# EAGLE design sls_v1.0 (EAGLE 9.6.2)
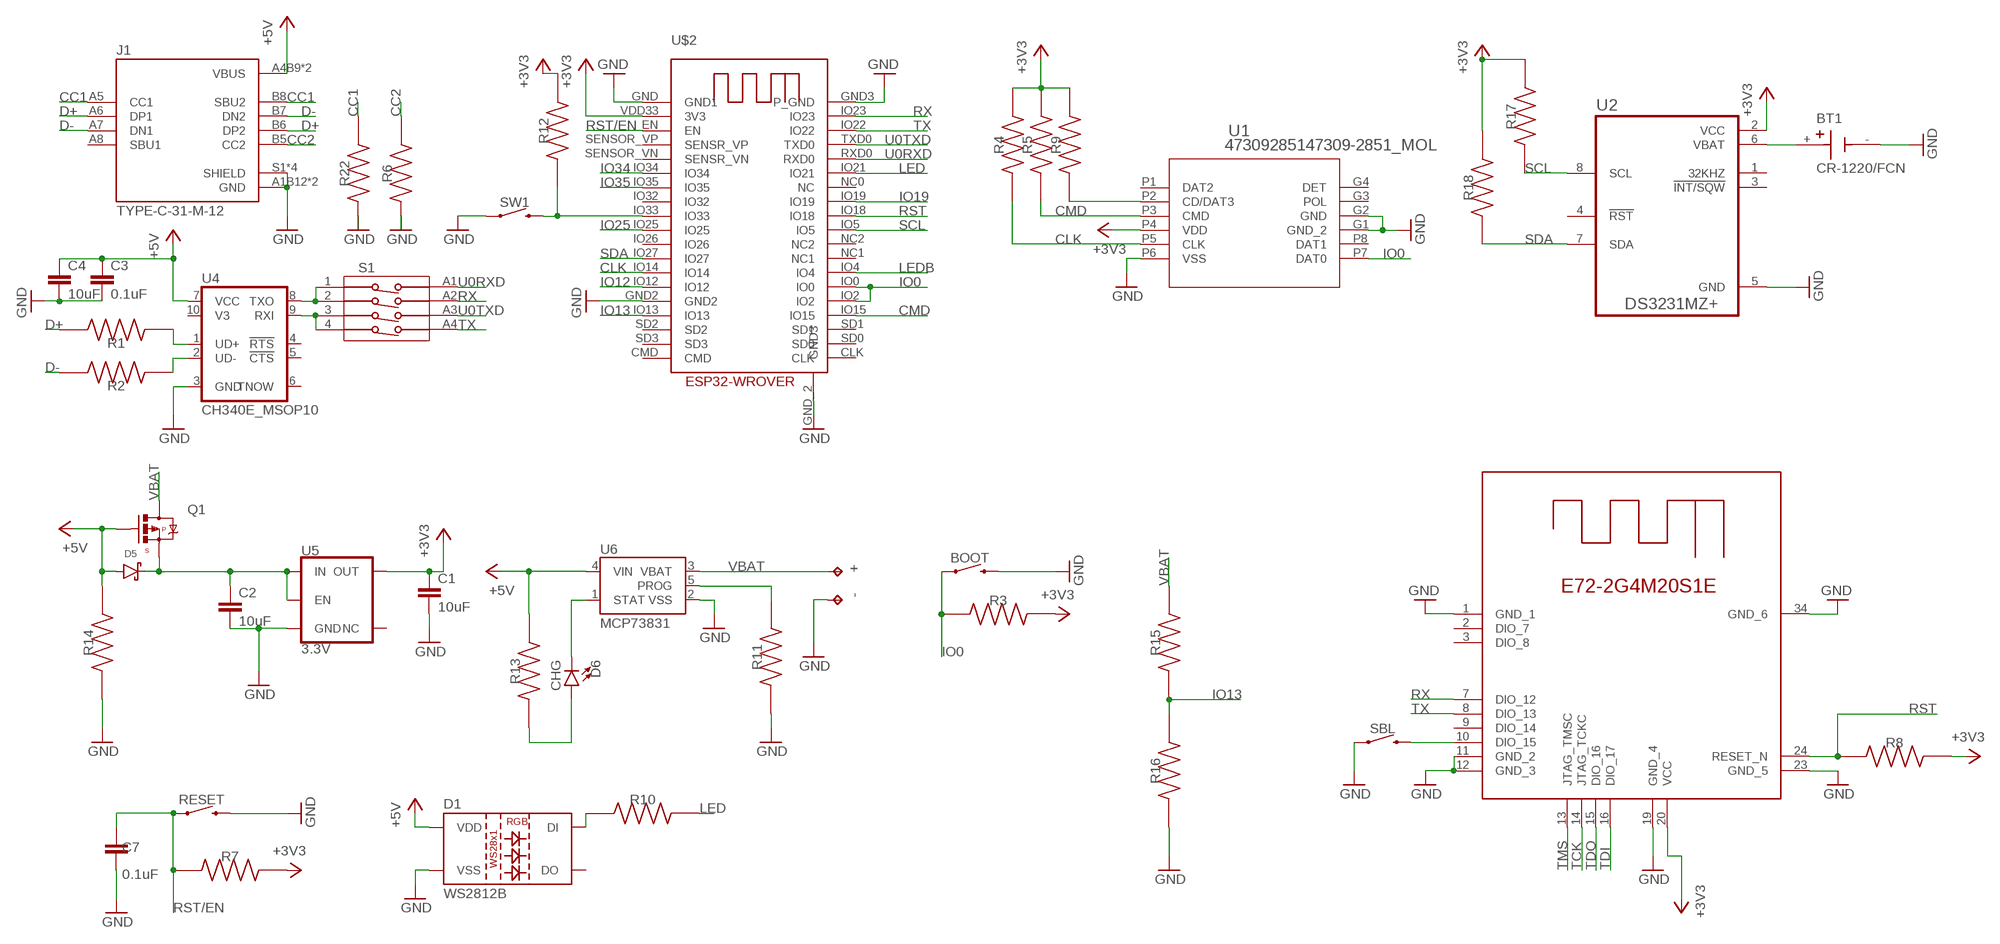
[diagram p0: schematic, sheet 1]

## Parts
+  TPTP14R  [TP14R]
-  TPTP14R  [TP14R]
BOOT  MOMENTARY-SWITCH-SPST-SMD-4.6X2.8MM  [TACTILE_SWITCH_SMD_4.6X2.8MM]
BT1  CR-1220/FCN  [BAT_CR-1220/FCN]
C1  10uF  10UF-0805-10V-10%  [0805]
C2  10uF  10UF-0805-10V-10%  [0805]
C3  0.1uF  0.1UF-0603-25V-(+80/-20%)  [0603]
C4  10uF  10UF-0603-6.3V-20%  [0603]
C7  0.1uF  0.1UF-0603-25V-5%  [0603]
D1  WS2812B  [WS2812B]
D5  DIODE-SCHOTTKY  [SOD-323]
D6  CHG  LED-BLUE0603  [LED-0603]
J1  TYPE-C-31-M-12  [HRO_TYPE-C-31-M-12]
Q1  MOSFET-PCHANNEL  [SOT23]
R1  RC0402FR-073M6L  [RESC1005X40N]
R2  RC0402FR-073M6L  [RESC1005X40N]
R3  RC0402FR-073M6L  [RESC1005X40N]
R4  RC0402FR-073M6L  [RESC1005X40N]
R5  RC0402FR-073M6L  [RESC1005X40N]
R6  5.1k  RC0402FR-073M6L  [RESC1005X40N]
R7  RC0402FR-073M6L  [RESC1005X40N]
R8  100k  RC0402FR-073M6L  [RESC1005X40N]
R9  RC0402FR-073M6L  [RESC1005X40N]
R10  RC0402FR-073M6L  [RESC1005X40N]
R11  2.7k  RC0402FR-073M6L  [RESC1005X40N]
R12  RC0402FR-073M6L  [RESC1005X40N]
R13  RC0402FR-073M6L  [RESC1005X40N]
R14  RC0402FR-073M6L  [RESC1005X40N]
R15  RC0402FR-073M6L  [RESC1005X40N]
R16  RC0402FR-073M6L  [RESC1005X40N]
R17  RC0402FR-073M6L  [RESC1005X40N]
R18  RC0402FR-073M6L  [RESC1005X40N]
R22  5.1k  RC0402FR-073M6L  [RESC1005X40N]
RESET  MOMENTARY-SWITCH-SPST-SMD-4.6X2.8MM  [TACTILE_SWITCH_SMD_4.6X2.8MM]
S1  416131160804  [416131160804]
SBL  MOMENTARY-SWITCH-SPST-SMD-4.6X2.8MM  [TACTILE_SWITCH_SMD_4.6X2.8MM]
SW1  MOMENTARY-SWITCH-SPST-SMD-4.6X2.8MM  [TACTILE_SWITCH_SMD_4.6X2.8MM]
U1  47309285147309-2851_MOL  [47309-2851_MOL]
U2  DS3231MZ+  [SOIC127P600X175-8N]
U4  CH340E_MSOP10  [MSOP10]
U5  3.3V  V_REG_AP2112K-3.3V  [SOT23-5]
U6  MCP73831  [SOT23-5]
U$1  E72-2G4M20S1E  [E72-2G4M20S1E]
U$2  ESP32-WROVER  [ESP32-WROVER]

## Nets
+3V3: C1.1 R3.2 R4.2 R5.2 R7.2 R8.2 R9.2 R12.2 R17.2 R18.2 U1.P4(VDD) U2.2(VCC) U5.5(OUT) U$1.20(VCC) U$2.VDD33(3V3)
+5V: C3.1 C4.1 D1.1(VDD) D5.A J1.A4B9(VBUS) J1.B4A9(VBUS) Q1.1(G) R13.2 R14.2 U4.7(VCC) U6.4(VIN)
CC1: J1.A5(CC1) J1.B8(SBU2) R22.2
CC2: J1.B5(CC2) R6.2
CLK: R4.1 U1.P5(CLK) U$2.IO14
CMD: R5.1 U1.P3(CMD) U$2.IO15
D+: J1.A6(DP1) J1.B6(DP2) R1.2
D-: J1.A7(DN1) J1.B7(DN2) R2.2
GND: -.TP BOOT.3 BOOT.4 BT1.- C1.2 C2.2 C3.2 C4.2 C7.2 D1.3(VSS) J1.A1B12(GND) J1.B1A12(GND) J1.S1(SHIELD) J1.S2(SHIELD) J1.S3(SHIELD) J1.S4(SHIELD) R6.1 R11.1 R14.1 R16.1 R22.1 RESET.3 RESET.4 SBL.1 SBL.2 SW1.1 SW1.2 U1.G1(GND_2) U1.G2(GND) U1.P6(VSS) U2.5(GND) U4.3(GND) U5.2(GND) U6.2(VSS) U$1.1(GND_1) U$1.11(GND_2) U$1.12(GND_3) U$1.19(GND_4) U$1.23(GND_5) U$1.34(GND_6) U$2.GND2 U$2.GND3(P_GND) U$2.GND(GND1) U$2.GND_2(GND3)
IO0: BOOT.1 BOOT.2 R3.1 U1.P7(DAT0) U$2.IO0 U$2.IO2
IO12: U$2.IO12
IO13: R15.1 R16.2 U$2.IO13
IO19: U$2.IO19
IO25: U$2.IO25
IO34: U$2.IO34
IO35: U$2.IO35
LED: R10.2 U$2.IO21
LEDB: U$2.IO4
N$1: BT1.+ U2.6(VBAT)
N$2: R1.1 U4.1(UD+)
N$3: S1.1 S1.2 U4.8(TXO)
N$4: S1.3 S1.4 U4.9(RXI)
N$5: C2.1 D5.C Q1.2(S) U5.1(IN) U5.3(EN)
N$6: R12.1 SW1.3 SW1.4 U$2.IO33
N$7: R2.1 U4.2(UD-)
N$8: SBL.3 SBL.4 U$1.10(DIO_15)
N$9: R9.1 U1.P2(CD/DAT3)
N$10: R11.2 U6.5(PROG)
N$11: D6.A R13.1
N$12: D1.4(DI) R10.1
N$13: D6.C U6.1(STAT)
RST: R8.1 U$1.24(RESET_N) U$2.IO18
RST/EN: C7.1 R7.1 RESET.1 RESET.2 U$2.EN
RX: S1.A2 U$1.7(DIO_12) U$2.IO23
SCL: R17.1 U2.8(SCL) U$2.IO5
SDA: R18.1 U2.7(SDA) U$2.IO27
TCK: U$1.14(JTAG_TCKC)
TDI: U$1.16(DIO_17)
TDO: U$1.15(DIO_16)
TMS: U$1.13(JTAG_TMSC)
TX: S1.A4 U$1.8(DIO_13) U$2.IO22
U0RXD: S1.A1 U$2.RXD0
U0TXD: S1.A3 U$2.TXD0
VBAT: +.TP Q1.3(D) R15.2 U6.3(VBAT)
Unconnected: D1.2(DO) J1.A8(SBU1) U1.G3(POL) U1.G4(DET) U1.P1(DAT2) U1.P8(DAT1) U2.1(32KHZ) U2.3(!INT/SQW) U2.4(!RST) U4.4(!RTS) U4.5(!CTS) U4.6(TNOW) U4.10(V3) U5.4(NC) U$1.2(DIO_7) U$1.3(DIO_8) U$1.9(DIO_14) U$2.CLK U$2.CMD U$2.IO26 U$2.IO32 U$2.NC0(NC) U$2.NC1 U$2.NC2 U$2.SD0 U$2.SD1 U$2.SD2 U$2.SD3 U$2.SENSOR_VN(SENSR_VN) U$2.SENSOR_VP(SENSR_VP)

## Library data of the parts
+ - = testpad:TP: Test pad
BOOT RESET SBL SW1 = SparkFun-Switches:MOMENTARY-SWITCH-SPST: Momentary Switch (Pushbutton) - SPST Normally-open (NO) SPST momentary switches (buttons, pushbuttons). Variants PTH-12MM - 12mm square, through-hole Momentary Pushbutton Switch - 12mm Square <https://www.sparkfun.com/products/9190> (COM-09190) PTH-6.0MM, PTH-6.0MM-KIT - 6.0mm square, through-hole Mini Pushbutton Switch <https://www.sparkfun.com/products/97> (COM-00097) KIT package intended for soldering kit's - only one side of pads' copper is exposed. PTH-RIGHT-ANGLE-KIT - Right-angle, through-hole Right Angle Tactile Button <https://www.sparkfun.com/products/10791> - Used on SparkFun BigTime Watch Kit <https://www.sparkfun.com/products/11734> SMD-12MM - 12mm square, surface-mount Tactile Button - SMD (12mm) <https://www.sparkfun.com/products/12993> (COM-12993) Used on SparkFun PicoBoard <https://www.sparkfun.com/products/11888> SMD-4.5MM - 4.5mm Square Trackball Switch Used on SparkFun Blackberry Trackballer Breakout <https://www.sparkfun.com/products/13169> SMD-4.6MMX2.8MM - 4.60mm x 2.80mm, surface mount Used on SparkFun SAMD21 Mini Breakout <https://www.sparkfun.com/products/13664> SMD-5.2MM, SMD-5.2-REDUNDANT - 5.2mm square, surface-mount Mini Pushbutton Switch - SMD <https://www.sparkfun.com/products/8720> (COM-08720) Used on Arduino Pro Mini <https://www.sparkfun.com/products/11114> REDUNDANT package connects both switch circuits together SMD-6.0X3.5MM - 6.0 x 3.5mm, surface mount Momentary Reset Switch SMD <https://www.sparkfun.com/products/8229> (COM-08229) SMD-6.2MM-TALL - 6.2mm square, surface mount Tactile Button - SMD (6mm) <https://www.sparkfun.com/products/12992> Used on SparkFun Digital Sandbox <https://www.sparkfun.com/products/12651> SMD-RIGHT-ANGLE - Right-angle, surface mount Used on SparkFun Block for Intel® Edison - Arduino <https://www.sparkfun.com/products/13036>; PROD_ID: SWCH-13065
BT1 = CR-1220_FCN:CR-1220/FCN: Coin, 12.5mm Lithium Manganese Dioxide 3V Battery Non-Rechargeable (Primary) Check prices <https://pricing.snapeda.com/parts/CR-1220/FCN/Panasonic%20-/view-part?ref=eda>; AVAILABILITY: In Stock; DESCRIPTION: Coin, 12.5mm Lithium Manganese Dioxide 3V Battery Non-Rechargeable (Primary); MF: Panasonic -; MP: CR-1220/FCN; PACKAGE: Panasonic -; PRICE: None; PURCHASE-URL: https://pricing.snapeda.com/search/part/CR-1220/FCN/?ref=eda
C1 C2 = SparkFun-Capacitors:10UF: 10.0µF ceramic capacitors A capacitor is a passive two-terminal electrical component used to store electrical energy temporarily in an electric field.; PROD_ID: CAP-11330
C3 = SparkFun-Capacitors:0.1UF: 0.1µF ceramic capacitors A capacitor is a passive two-terminal electrical component used to store electrical energy temporarily in an electric field.; PROD_ID: CAP-00810
C4 = SparkFun-Capacitors:10UF: 10.0µF ceramic capacitors A capacitor is a passive two-terminal electrical component used to store electrical energy temporarily in an electric field.; PROD_ID: CAP-11015
C7 = SparkFun-Capacitors:0.1UF: 0.1µF ceramic capacitors A capacitor is a passive two-terminal electrical component used to store electrical energy temporarily in an electric field.; PROD_ID: CAP-08604
D1 = SparkFun-LED:WS2812B: WS2812B SMD addressable RGB LED 5x5mm SMD LED with built-in controller IC. Color: Red/Green/Blue mC Rating: RGB: 390, 660, 180 mcd Forward Voltage: RGB: 2.0, 3.0, 3.0 V Packages:WS2812B SparkFun Products: Blynk Board - ESP8266 <https://www.sparkfun.com/products/13794>; PROD_ID: DIO-12503
D5 = pimoroni-passives:DIODE-SCHOTTKY
D6 = SparkFun-LED:LED-BLUE: Blue SMD LED Used in manufacturing of various products at SparkFun Packages: 0603 - SMD 0603 package [Product Link] <http://www.digikey.com/product-detail/en/SMLE12BC7TT86/511-1589-2-ND/1641808> 1206 - SMD1206 package [Product Link] <http://www.digikey.com/product-detail/en/lite-on-inc/LTST-C150TBKT/160-1643-1-ND/573584> SparkFun Products: ESP8266 Thing-Dev Board <https://www.sparkfun.com/products/13711> RedBoard <https://www.sparkfun.com/products/12757>; PROD_ID: DIO-08575; VALUE: BLUE
J1 = TYPE-C-31-M-12:TYPE-C-31-M-12: USB Connectors 24 Receptacle 1 8.94*7.3mm RoHS; AVAILABILITY: Unavailable; DESCRIPTION: USB Connectors 24 Receptacle 1 8.94*7.3mm RoHS; MF: HRO Electronics Co., Ltd.; MP: TYPE-C-31-M-12; PACKAGE: Package; PRICE: None
Q1 = pimoroni-passives:MOSFET-PCHANNEL: Generic PMOSFET
R1-R18 R22 = RC0402FR-073M6L:RC0402FR-073M6L: RESISTOR, 0402 0.063W 1% 3M6; Resistance:3.6Mohm; Resistance Tolerance:± 1%; Power Rating:0.063W; Voltage Rating:50V; Series:RC32H; Temperature Coefficient:± 100ppm/°C; Resistor Element Type:Thick Film; Resistor Case Style:0402; No. of Pins:2; SVHC:No SVHC; Case Style:0402; External Length / Height:1mm; Temperature Coeff. +:100ppm/°C; Temperature Coeff. -:100ppm/°C; External Depth:0.35mm; External Width:0.5mm; Operating Temperature Range:-55°C to +155°C; Overload Voltage:100V Check prices <https://pricing.snapeda.com/parts/RC0402FR-073M6L/Yageo/view-part?ref=eda>; AVAILABILITY: Good; DESCRIPTION: RESISTOR, 0402 0.063W 1% 3M6; Resistance:3.6Mohm; Resistance Tolerance:± 1%; Power Rating:0.063W; Voltage Rating:50V; Series:RC32H; Temperature Coefficient:± 100ppm/°C; Resistor Element Type:Thick Film; Resistor Case Style:0402; No. of Pins:2; SVHC:No SVHC; Case Style:0402; External Length / Height:1mm; Temperature Coeff. +:100ppm/°C; Temperature Coeff. -:100ppm/°C; External Depth:0.35mm; External Width:0.5mm; Operating Temperature Range:-55°C to +155°C; Overload Voltage:100V; MF: Yageo; MP: RC0402FR-073M6L; PACKAGE: 1005 Panasonic Electronic Components; PRICE: None; PURCHASE-URL: https://pricing.snapeda.com/search/part/RC0402FR-073M6L/?ref=eda
S1 = Dip_Switch_SPST_4:416131160804: WS-DISV 1.27mm small compact SMD flat actuator with top tape Specification MATERIAL PROPERTIES: Cover Material PPA Cover Flammability Rating UL94 V-0 Cover Color Brown Base Material PPA Base Flammability Rating UL94 V-0 Base Color Brown Actuator Material PA46 Actuator Flammability Rating UL94 V-0 Actuator Color White Contact Plating Gold Terminal Plating Gold ELECTRICAL PROPERTIES: Rated Current Switching 25 mA Rated Current Non-Switching 100 mA Contact Resistance Initial 100 mΩ Contact Resistance After Life Test 200 mΩ Insulation Resistance 100 MΩ Withstanding Voltage 300 V (AC) MECHANICAL PROPERTIES: Operation Force 500 g Electrical Life 1000 Cycles Mechanical Life min. 2000 cycles Actuator Type Flat Type Switch Position Off <http://katalog.we-online.de/media/images/v2/Family_WS-DISV_SMD_FLAT_ACTUATOR_4161311608xx_4C.jpg> Details see: http://katalog.we-online.de/en/em/DISV_1_27_SMALL_COMPACT_SMD_FLAT_ACTUATOR/416131160804 2015 (C) Wurth Elektronik Check prices <https://pricing.snapeda.com/parts/416131160804/Wurth%20Elektronik/view-part?ref=eda>; AVAILABILITY: In Stock; DESCRIPTION: Dip Switch SPST 4 Position Surface Mount Slide (Standard) Actuator 25mA 24VDC; MF: Wurth Elektronik; MP: 416131160804; PACKAGE: None; PRICE: None; PURCHASE-URL: https://pricing.snapeda.com/search/part/416131160804/?ref=eda
U1 = microSD_smt:473092851; COPYRIGHT: Copyright (C) 2021 Ultra Librarian. All rights reserved.; MANUFACTURER_PART_NUMBER: 473092851; MFR_NAME: Molex Connector Corporation
U2 = DS3231MZ_:DS3231MZ+: Check prices <https://pricing.snapeda.com/parts/DS3231MZ%2B/Maxim%20Integrated/view-part?ref=eda>; AVAILABILITY: Warning; DESCRIPTION: Real Time Clock (RTC) IC Clock/Calendar I²C, 2-Wire Serial 8-SOIC (0.154, 3.90mm Width); MF: Maxim Integrated; MP: DS3231MZ+; PACKAGE: SOIC-8 Maxim; PRICE: None; PURCHASE-URL: https://pricing.snapeda.com/search/part/DS3231MZ+/?ref=eda
U4 = CH340E:CH340E: Check prices <https://pricing.snapeda.com/parts/CH340E/WCH/view-part?ref=eda>; AVAILABILITY: Not in stock; DESCRIPTION: USB to serial chip CH340; MF: WCH; MP: CH340E; PACKAGE: Package; PRICE: None
U5 = SparkFun-IC-Power:V_REG_AP2112: AP2112 - 600mA CMOS LDO Regulator w/ Enable The AP2112 is CMOS process low dropout linear regulator with enable function, the regulator delivers a guaranteed 600mA (min.) continuous load current. Features Output Voltage Accuracy: ±1.5% Output Current: 600mA (Min.) Foldback Short Current Protection: 50mA Enable Function to Turn ON/OFF VOUT Low Dropout Voltage (3.3V): 250mV (Typ.) @IOUT=600mA Excellent Load Regulation: 0.2%/A (Typ.) Excellent Line Regulation: 0.02%/V (Typ.) Low Quiescent Current: 55μA (Typ.) Low Standby Current: 0.01μA (Typ.) Low Output Noise: 50μVRMS PSRR: 100Hz -65dB, 1kHz -65dB OTSD Protection Stable with 1.0μF Flexible Cap: Ceramic, Tantalum and Aluminum Electrolytic Operation Temperature Range: -40°C to 85°C ESD: MM 400V, HBM 4000V; PROD_ID: VREG-12457
U6 = SparkFun-IC-Power:MCP73831: MCP73831T Li-Ion, Li-Pol Controller Miniature single cell, fully integrated Li-Ion, Li-polymer charge management controller Datasheet <http://ww1.microchip.com/downloads/en/DeviceDoc/20001984g.pdf> SparkFun Products: SparkFun ESP32 Thing <https://www.sparkfun.com/products/13907> SparkFun 9DoF Razor IMU M0 <https://www.sparkfun.com/products/14001>; PROD_ID: IC-09995
U$1 = E72-2G4M20S1E_M:E72-2G4M20S1E
U$2 = 32teeth - ESP32-WROVER:ESP32-WROVER

## Board
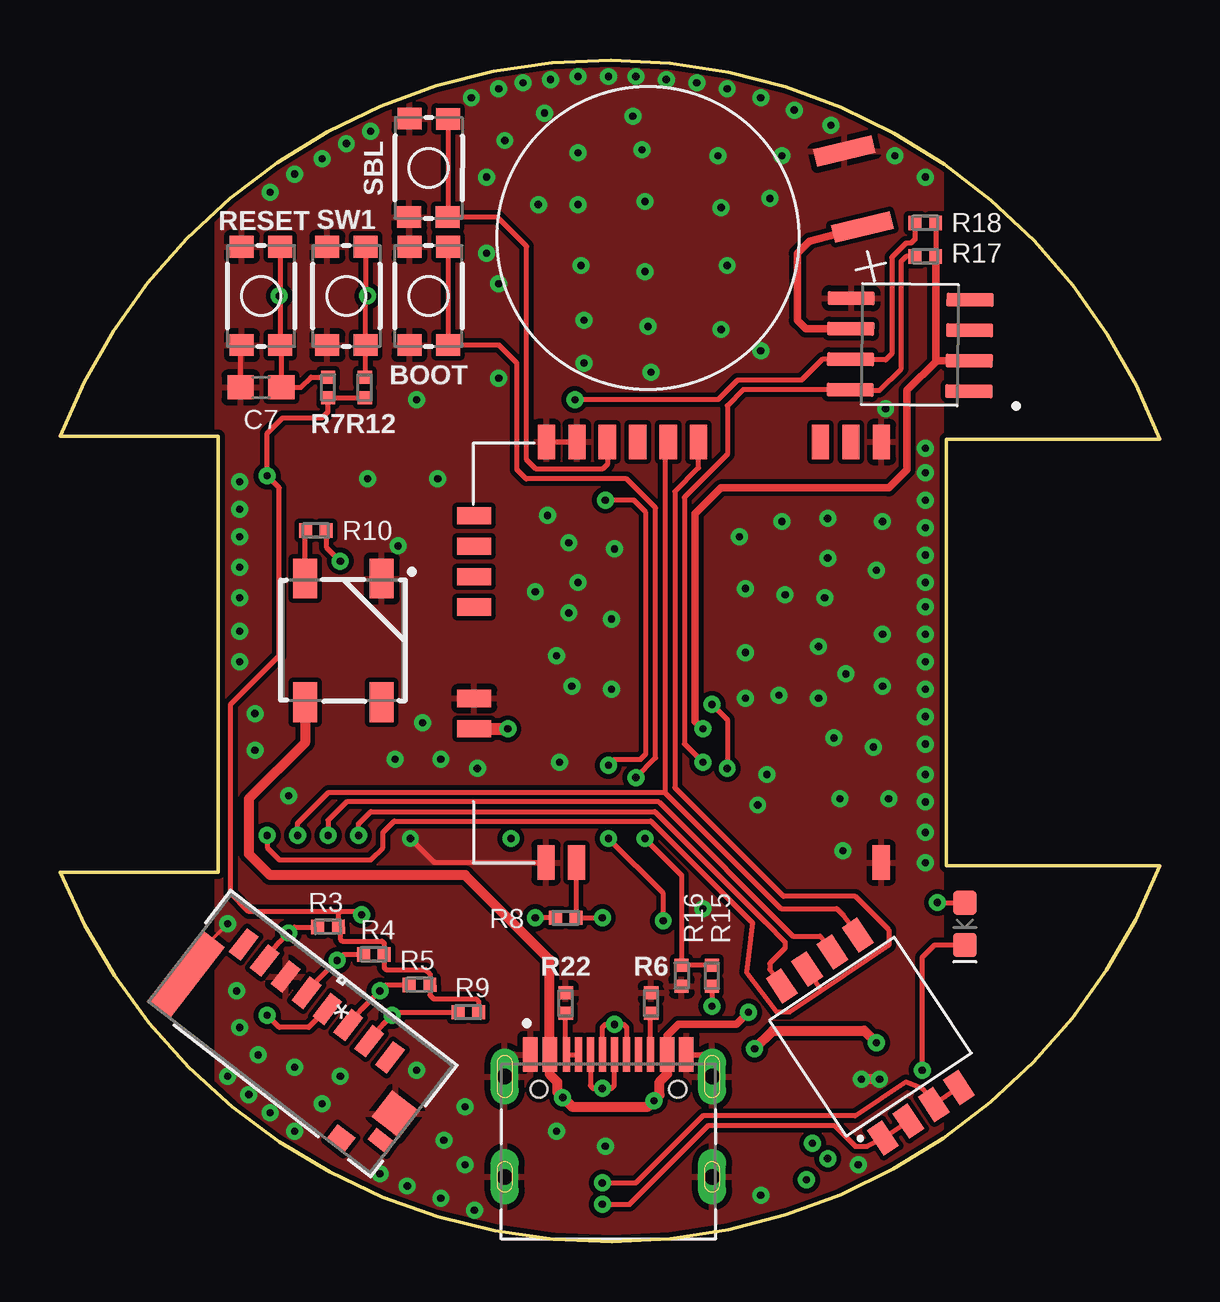
[diagram p1: board, top side]
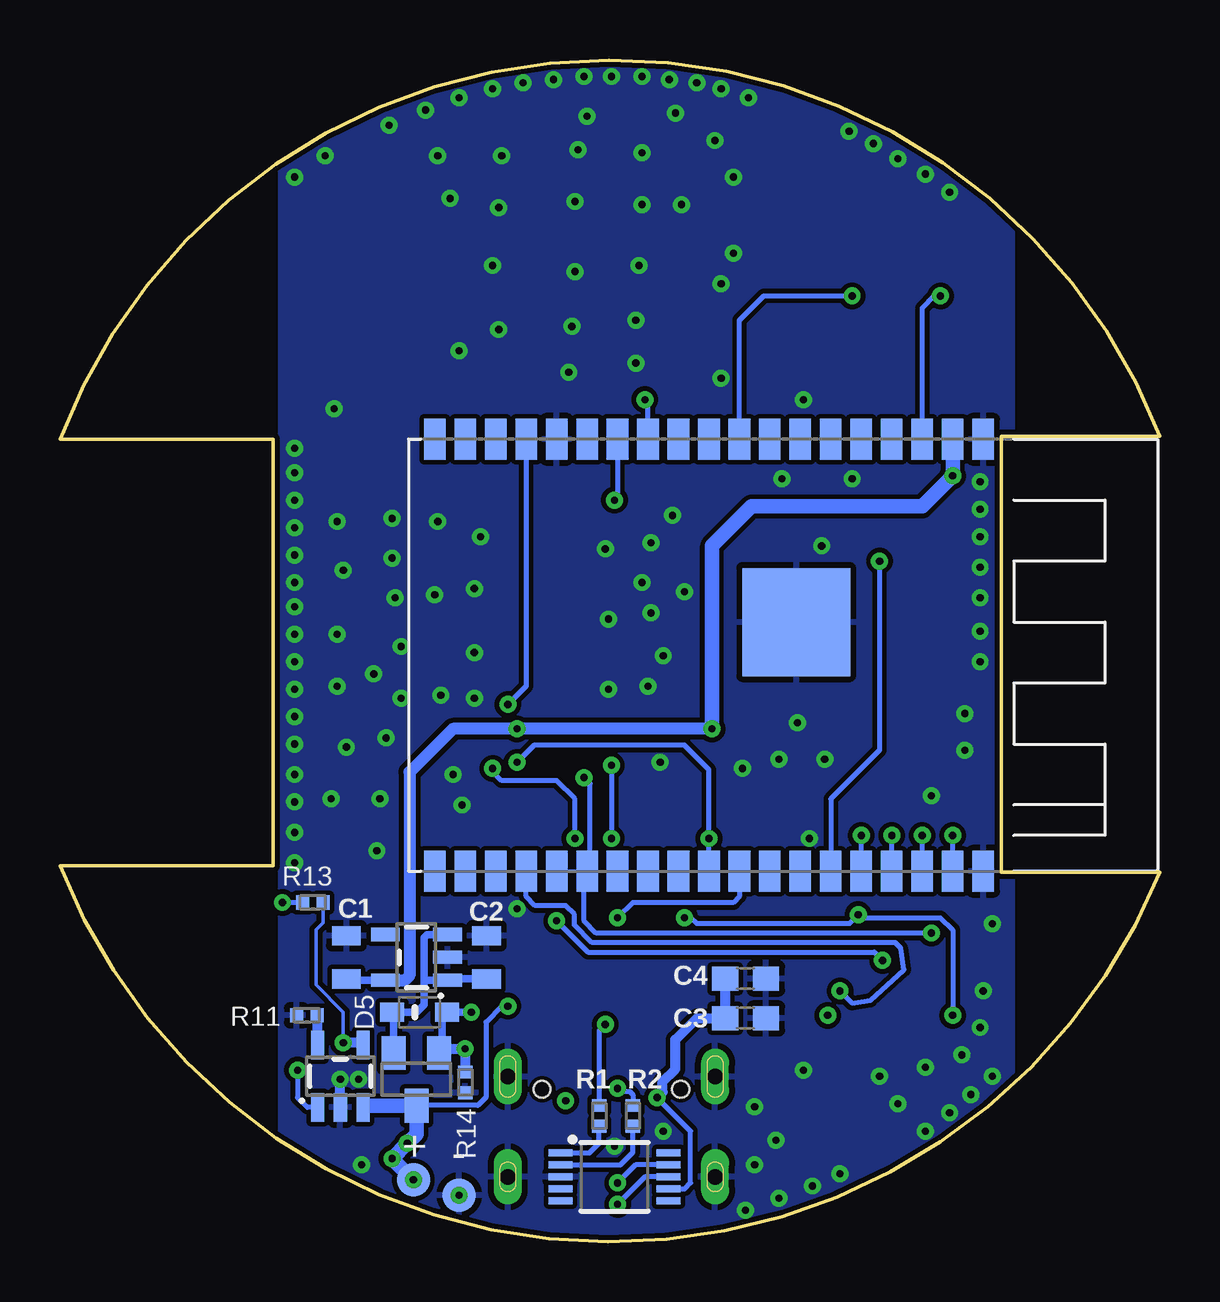
[diagram p2: board, bottom side, seen from below]

Size 45.85 x 49.24 mm. Coordinates in mm from the lower left corner, seen from the top.
Outline: 6.6,33.57 6.6,15.41 0,15.41 arc137 45.85,15.66 36.96,15.66 36.96,33.44 45.85,33.44 arc138 0,33.57 6.6,33.57
Copper layers (1*16): Top 0.035mm / dielectric 0.2mm / Bottom 0.035mm
Design rules "default *": minimum track width 6mil, minimum drill 0.3mm, track to track 0.2mm, track to pad 6mil, pad to pad 6mil, via to via 6mil, smd to smd 6mil, copper to edge 0.2mm, drill to drill 0.3mm, minimum pad ring 10mil, minimum via ring 8mil, stop-mask expansion 4mil, vias tented up to drill 0.3mm, thermal gap 10mil

### Footprints (pad centres in the part's own frame; a part is rotated, then mirrored left to right if it is on the bottom)
TP14R = smd 1.4 x 1.4: TP 0,0
TACTILE_SWITCH_SMD_4.6X2.8MM = smd 0.9 x 1: 1 -2.05,-0.8; 2 2.05,-0.8; 3 2.05,0.8; 4 -2.05,0.8
BAT_CR-1220/FCN = smd 2.5 x 0.75: + 8.8,-1.625; - 8.8,1.625
0805 = smd 0.8 x 1.2: 1 -0.9,0; 2 0.9,0
0603 = smd 1.1 x 1: 1 -0.85,0; 2 0.85,0
WS2812B = smd 1.651 x 1: 1 2.577,-1.6; 2 2.577,1.6; 3 -2.577,1.6; 4 -2.577,-1.6
SOD-323 = smd 1 x 0.8: A 1.15,0; C -1.15,0
LED-0603 = smd 1 x 1: A -0.877,0; C 0.877,0
HRO_TYPE-C-31-M-12 = smd 0.6 x 1.45: A1B12 -3.25,5.095; A4B9 -2.45,5.095; B1A12 3.25,5.095; B4A9 2.45,5.095 | smd 0.3 x 1.45: A5 -1.25,5.095; A6 -0.25,5.095; A7 0.25,5.095; A8 1.25,5.095; B5 1.75,5.095; B6 0.75,5.095; B7 -0.75,5.095; B8 -1.75,5.095 | drill 0.65 pad 1.05 long: S1 -4.32,4.18; S2 4.32,4.18; S3 -4.32,0; S4 4.32,0 | hole 0.7: -2.89,3.65; 2.89,3.65
SOT23 = smd 1 x 1.4: 1 -0.95,-1.1; 2 0.95,-1.1; 3 0,1.1
RESC1005X40N = smd 0.54 x 0.6: 1 -0.432,0; 2 0.432,0
416131160804 = smd 0.76 x 1.27: 1 -1.905,-3.81; 2 -0.635,-3.81; 3 0.635,-3.81; 4 1.905,-3.81; A1 -1.905,3.81; A2 -0.635,3.81; A3 0.635,3.81; A4 1.905,3.81
47309-2851_MOL = smd 1.194 x 3.785: G1 -5.3,-0.986 | smd 1.448 x 1.397: G2 5.175,-0.231 | smd 0.991 x 0.61: G3 5.4,-1.481 | smd 0.94 x 0.838: G4 4,-2.456 | smd 0.61 x 1.245: P1 3.55,1.494; P2 2.45,1.494; P3 1.35,1.494; P4 0.25,1.494; P5 -0.85,1.494; P6 -1.95,1.494; P7 -3.05,1.494; P8 -4.15,1.494
SOIC127P600X175-8N = smd 1.97 x 0.59: 1 -2.475,1.905; 2 -2.475,0.635; 3 -2.475,-0.635; 4 -2.475,-1.905; 5 2.475,-1.905; 6 2.475,-0.635; 7 2.475,0.635; 8 2.475,1.905
MSOP10 = smd 1 x 0.3: 1 -2.25,1; 2 -2.25,0.5; 3 -2.25,0; 4 -2.25,-0.5; 5 -2.25,-1; 6 2.25,-1; 7 2.25,-0.5; 8 2.25,0; 9 2.25,0.5; 10 2.25,1
SOT23-5 = smd 0.55 x 1.2: 1 -0.95,-1.3; 2 0,-1.3; 3 0.95,-1.3; 4 0.95,1.3; 5 -0.95,1.3
E72-2G4M20S1E = smd 0.711 x 1.422: 1 17.098,17.538; 2 15.828,17.538; 3 14.558,17.538; 7 9.478,17.538; 8 8.208,17.538; 9 6.938,17.538; 10 5.668,17.538; 11 4.398,17.538; 12 3.128,17.538; 23 3.115,0.016; 24 4.385,0.016; 34 17.085,0.016 | smd 1.422 x 0.711: 13 0.119,14.471; 14 0.119,13.201; 15 0.119,11.931; 16 0.119,10.661; 19 0.119,6.851; 20 0.119,5.581
ESP32-WROVER = smd 1.7 x 0.9: CLK 18,1.27; CMD 0,1.27; EN 0,21.59; GND 0,24.13; GND3 18,24.13; GND_2 0,6.35; IO0 18,7.62; IO2 18,6.35; IO4 18,8.89; IO5 18,12.7; IO12 0,7.62; IO13 0,5.08; IO14 0,8.89; IO15 18,5.08; IO18 18,13.97; IO19 18,15.24; IO21 18,17.78; IO22 18,21.59; IO23 18,22.86; IO25 0,12.7; IO26 0,11.43; IO27 0,10.16; IO32 0,15.24; IO33 0,13.97; IO34 0,17.78; IO35 0,16.51; NC0 18,16.51; NC1 18,10.16; NC2 18,11.43; RXD0 18,19.05; SD0 18,2.54; SD1 18,3.81; SD2 0,3.81; SD3 0,2.54; SENSOR_VN 0,19.05; SENSOR_VP 0,20.32; TXD0 18,20.32; VDD33 0,22.86 | smd 4.5 x 4.5: GND2 7.62,16.34

### Placement (x,y rotation side)
+  31.12,2.58 0 bottom
-  29.21,1.95 0 bottom
BOOT  15.37,39.41 90 top
BT1  24.51,41.82 13.4 top
C1  33.91,11.85 90 bottom
C2  28.07,11.85 90 bottom
C3  17.27,9.31 0 bottom
C4  17.27,10.96 0 bottom
C7  8.38,35.6 180 top
D1  11.81,25.06 270 top
D5  30.86,9.57 0 bottom
D6  37.72,13.25 270 top
J1  22.86,2.71 0 top
Q1  30.99,6.77 180 bottom
R1  23.37,5.25 90 bottom
R2  21.97,5.25 90 bottom
R3  11.18,13.12 0.8 top
R4  13.08,11.98 0 top
R5  14.99,10.71 0.4 top
R6  24.64,9.95 270 top
R7  11.18,35.6 270 top
R8  21.08,13.5 180 top
R9  17.02,9.57 0 top
R10  10.67,29.63 0 top
R11  35.56,9.44 0 bottom
R12  12.7,35.6 270 top
R13  35.31,14.14 0 bottom
R14  28.96,6.65 90 bottom
R15  27.18,11.09 270 top
R16  25.91,11.09 90 top
R17  36.07,41.06 0 top
R18  36.07,42.46 0 top
R22  21.08,9.95 270 top
RESET  8.38,39.41 90 top
S1  33.78,8.55 33.6 top
SBL  15.37,44.75 269.8 top
SW1  11.94,39.41 270 top
U1  10.03,8.68 322.3 top
U2  35.43,37.38 179.3 top
U4  22.73,2.71 0 bottom
U5  30.99,11.85 90 bottom
U6  34.16,6.9 0 bottom
U$1  17.14,15.79 0 top
U$2  31.5,33.44 270 bottom

### Tracks (layer width: path | path; a pad name or v marks a point on that pad's centre or on a via)
+3V3  (via drill 0.3)
  Top 0.2: R9.2 17.45,10.02 17.36,10.12 15.58,10.12 15.42,10.28 R5.2 15.42,11.17 15.24,11.34 13.59,11.34 13.51,11.42 R4.2 13.51,12.44 13.42,12.53 11.77,12.53 11.68,12.61 11.68,13.05 R3.2 11.61,13.68 11.68,13.76 | R8.2 v19.81,13.5 | 11.68,13.76 12.45,13.76 v12.57,13.63 | U1.P4 10.37,8.93 9.14,8.93 v8.64,9.44 | R18.2 R17.2 | 11.68,13.76 7.87,13.76 7.11,14.52 7.11,22.39 9.14,24.43 9.14,31.41 v8.64,31.92 8.64,33.7 9.27,34.33 10.92,34.33 11.18,34.59 R7.2 R12.2
  Top 0.305: U2.2 36.55,36.71 | 36.55,36.71 35.31,35.47 35.31,32.17 34.54,31.41 27.56,31.41 26.48,30.33 26.48,21.7 v26.8,21.38 | 36.55,36.71 36.5,36.76 R17.2
  Top 0.508: U$1.20 18.66,21.37 v18.67,21.38
  Bottom 0.2: v19.81,13.5 19.54,13.5 19.3,13.27 12.94,13.27 v12.57,13.63 12.45,13.5 9.14,13.5 8.64,13 v8.64,9.44
  Bottom 0.305: U5.5 33.86,10.9 C1.1
  Bottom 0.508: U5.5 31.46,10.9 31.27,11.09 31.27,19.57 29.46,21.38 v26.8,21.38 v18.67,21.38
  Bottom 0.61: v18.67,21.38 18.67,29 17.02,30.65 9.91,30.65 v8.64,31.92 U$2.VDD33
+5V  (via drill 0.3)
  Top 0.305: J1.B4A9 25.31,8.59 25.78,9.06 28.19,9.06 v28.7,9.57
  Top 0.406: J1.B4A9 25.31,6.98 25,6.67 25,6.12 v24.77,5.88 24.51,5.63 21.34,5.63 v20.96,6.01 20.72,6.24 20.72,6.67 20.41,6.98 J1.A4B9 20.41,11.76 16.89,15.28 8.76,15.28 7.87,16.17 7.87,18.46 10.21,20.79 D1.1 | v28.96,8.04 29.72,8.8 33.53,8.8 v34.04,8.3
  Bottom 0.152: R13.2 34.87,13.3 35.18,13 35.18,10.71 34.04,9.57 v34.04,8.3
  Bottom 0.2: U4.7 19.8,2.21 19.56,2.45 19.56,4.61 v20.96,6.01
  Bottom 0.305: v28.7,9.57 D5.A 29.91,9.37 29.91,8 Q1.1
  Bottom 0.406: C4.1 C3.1 19.3,9.31 20.19,8.42 20.19,7.2 20.72,6.67 20.72,6.24 v20.96,6.01 | Q1.1 29.87,8.04 v28.96,8.04 R14.2 | U6.4 33.31,8.3 v34.04,8.3
  Bottom 0.508: 24.77,5.76 v24.77,5.88
CC1
  Top 0.2: R22.2 21.08,7.83 J1.B8 J1.A5
CC2
  Top 0.2: J1.B5 24.61,9.49 R6.2
CLK  (via drill 0.3)
  Top 0.2: U1.P5 10.79,10.96 v11.56,11.73 11.81,11.98 R4.1 | v22.86,19.85 23.11,20.11 24.2,20.11 24.43,20.33 24.43,30.39 23.92,30.9 v22.73,30.9 | v25.15,13.38 25.15,14.52 v22.86,16.81
  Bottom 0.2: U$2.IO14 22.61,31.03 v22.73,30.9 | v25.15,13.38 23.84,12.07 11.9,12.07 v11.56,11.73 | v22.86,19.85 v22.86,16.81
CMD  (via drill 0.3)
  Top 0.2: U1.P3 12.57,9.69 v13.34,10.46 13.59,10.71 R5.1
  Bottom 0.2: v13.34,10.46 12.83,9.95 12.06,10.07 10.67,11.34 10.79,12.23 11.03,12.47 23.66,12.47 24.4,13.21 24.4,13.65 24.77,14.01 26.04,14.01 26.42,14.39 U$2.IO15
D+  (via drill 0.3)
  Top 0.2: J1.A6 22.61,8.94 22.73,9.06 v23.11,9.06 23.5,9.06 23.62,8.93 J1.B6
  Bottom 0.2: v23.11,9.06 23.37,8.8 R1.2
D-  (via drill 0.3)
  Top 0.2: J1.B7 22.11,6.51 22.23,6.39 v22.61,6.39 22.99,6.39 23.11,6.52 J1.A7
  Bottom 0.2: v22.61,6.39 22.48,6.26 22.1,6.26 21.97,6.14 R2.2
GND  (via drill 0.3)
  Top 0.152: 5.29,11.09 U1.G1 5.24,11.5 v6.98,13.25
  Top 0.2: U$1.12 U$1.11 | U$1.23 15.61,15.81 v14.61,16.81 | J1.B1A12 26.78,7.8 27.18,7.41 J1.S2 | C7.2 7.53,37.31 RESET.4
  Top 0.406: v34.16,6.77 v33.4,6.77
  Bottom 0.2: J1.S4 27.18,3.73 | 27.95,12.87 C2.2
  Bottom 0.406: U6.2 v34.16,6.77
  other vias: 14.86,35.09 36.07,33.06 36.07,32.05 36.07,30.9 36.07,29.76 36.07,28.62 36.07,27.47 36.07,26.46 36.07,25.31 36.07,24.17 36.07,23.03 36.07,21.89 36.07,20.74 36.07,19.47 36.07,18.33 36.07,17.06 36.07,15.79 7.49,31.66 7.49,30.52 7.49,29.38 7.49,28.11 7.49,26.84 7.49,25.44 7.49,24.17 29.08,18.2 18.29,48.05 19.3,48.3 20.45,48.43 21.59,48.56 22.86,48.56 24,48.56 25.27,48.43 26.54,48.3 27.81,48.05 29.21,47.67 30.61,47.16 32.13,46.52 34.8,45.25 17.27,1.31 15.88,1.82 14.48,2.33 20.83,19.98 26.8,13.88 6.98,6.9 7.87,6.14 8.76,5.38 9.78,4.61 13.34,2.84 21.59,45.38 21.59,43.22 21.72,40.68 21.84,38.4 24.26,45.51 24.38,43.35 24.38,40.43 24.51,38.14 27.56,38.01 27.81,40.68 27.56,43.09 27.43,45.25 30.1,45.25 21.21,29.12 21.21,26.2 21.34,23.16 22.99,23.03 22.99,25.95 23.11,28.87 28.32,29.38 28.57,27.22 28.57,24.55 28.57,22.65 31.62,22.65 31.62,24.81 31.88,26.84 32,28.49 32,30.14 34.29,30.01 34.04,27.98 34.29,25.31 34.29,23.16 33.91,20.62 34.54,18.46 14.1,29 15.88,20.11 17.4,19.73 18.29,35.98 34.42,34.71 21.84,36.62 24.64,36.24 29.21,37.13 8.13,22.01 8.13,20.49 9.53,18.58 13.97,20.11 33.27,3.22 32.51,18.46 32.64,16.3 32.26,21 20.7,24.43 21.59,27.47 29.46,19.47 30.23,26.97 30.1,30.01 16,4.23 16.89,3.22 16.89,5.63 11.68,6.9 9.78,7.28 7.49,8.93 8.25,7.79 10.92,5.76 14.86,7.15 12.83,31.79 15.75,31.79 20.32,30.27 19.81,27.09 15.11,21.63 32.77,23.66 17.14,47.67 12.95,46.27 11.94,45.76 10.92,45.13 9.78,44.49 8.76,43.73 36.07,44.36 18.54,45.89 19.94,43.22 18.29,39.92 17.78,41.19 17.78,44.36 20.19,47.03 23.88,46.9 29.59,43.48 29.97,22.77 20.7,4.61 22.73,3.98 7.37,10.46 29.21,1.95
  pour Top: 6.48,49.44 6.48,-0.59 36.83,-0.59 36.83,49.44
  pour Bottom: 6.1,49.57 6.1,-0.47 36.7,-0.47 36.7,49.57
IO0  (via drill 0.3)
  Top 0.2: v24,19.35 24.83,20.17 24.83,30.59 23.62,31.79 19.43,31.79 19.05,32.17 19.05,36.62 18.31,37.36 BOOT.1 BOOT.2 | U1.P7 9.14,12.49 v9.53,12.87 9.77,13.12 R3.1
  Bottom 0.152: U$2.IO0 U$2.IO2
  Bottom 0.2: v9.53,12.87 23.5,12.87 24,13.38 24,15.32 U$2.IO0 23.75,15.57 23.75,19.09 v24,19.35
IO13  (via drill 0.3)
  Top 0.2: v27.18,22.39 27.81,21.76 v27.81,19.73 | R15.1 R16.2 25.91,15.28 v24.38,16.81
  Bottom 0.2: U$2.IO13 26.42,23.16 v27.18,22.39 | v24.38,16.81 24.38,18.46 25.15,19.22 27.43,19.22 27.81,19.6 v27.81,19.73
LED  (via drill 0.3)
  Top 0.2: R10.2 11.1,28.95 v11.68,28.36
  Bottom 0.2: U$2.IO21 13.72,18.46 11.68,20.49 v11.68,28.36
N$1
  Top 0.305: BT1.+ 31.24,41.7 30.73,41.19 30.73,38.4 31.09,38.04 U2.6
N$2
  Bottom 0.2: U4.1 23.77,3.71 23.37,4.11 R1.1
N$3  (via drill 0.3)
  Top 0.2: S1.1 34.34,4.35 | 34.34,4.35 S1.2 | v22.61,1.57 23.75,1.57 27.03,4.85 32.28,4.85 33.15,3.98 33.64,3.98 34.34,4.35
  Bottom 0.2: U4.8 21.46,2.71 v22.61,1.57
N$4  (via drill 0.3)
  Top 0.2: S1.3 | S1.3 S1.4 | S1.3 36.42,5.78 35.94,6.39 35.27,6.66 33.15,5.25 26.8,5.25 24,2.45 v22.61,2.45
  Bottom 0.2: U4.9 21.85,3.21 v22.61,2.45
N$5
  Bottom 0.305: 29.75,10.96 U5.1 | C2.1 29.64,10.95 U5.1 | Q1.2 31.94,9.49 D5.C 30.99,9.57 30.67,9.89 30.67,10.84 | U5.3 30.55,12.8 30.67,12.68 30.67,10.84 | U5.1 30.6,10.9 30.67,10.84
N$6  (via drill 0.3)
  Top 0.2: SW1.4 12.74,39.5 v12.83,39.41 12.74,39.32 SW1.3 12.74,36.07 R12.1
  Bottom 0.2: U$2.IO33 17.53,38.4 16.51,39.41 v12.83,39.41
N$7
  Bottom 0.2: U4.2 22.49,3.21 21.97,3.72 R2.1
N$8
  Top 0.2: U$1.10 22.81,32.4 22.61,32.19 19.85,32.19 19.45,32.59 19.45,41.48 18.24,42.69 SBL.3 16.17,42.71 SBL.4
N$9  (via drill 0.3)
  Top 0.2: U1.P2 13.46,9.06 v13.84,9.44 13.97,9.57 R9.1
N$10
  Bottom 0.2: 35.11,9.31 35.11,9.42 R11.2
  Bottom 0.406: U6.5 35.11,9.31
N$11  (via drill 0.3)
  Top 0.2: v36.58,14.14 37.71,14.14 D6.A
  Bottom 0.2: R13.1 v36.58,14.14
N$12
  Top 0.2: D1.4 10.21,29.61 R10.1
N$13  (via drill 0.3)
  Top 0.2: v35.94,7.15 35.94,11.85 36.46,12.37 D6.C
  Bottom 0.2: U6.1 35.53,5.6 35.94,6.01 v35.94,7.15
RST  (via drill 0.3)
  Top 0.2: U$1.24 21.51,15.79 R8.1 v22.61,13.5
  Bottom 0.2: U$2.IO18 17.53,14.39 17.78,14.14 21.97,14.14 v22.61,13.5
RST/EN  (via drill 0.3)
  Top 0.2: 11.16,36.05 R7.1 10.46,36.03 10.03,35.6 C7.1 9.23,37.31 RESET.1 RESET.2 9.18,39.45 v9.14,39.41
  Bottom 0.2: U$2.EN 9.91,38.9 9.4,39.41 v9.14,39.41
RX  (via drill 0.3)
  Top 0.2: U$1.7 26.62,32.25 25.63,31.26 25.63,18.92 30.16,14.39 33.15,14.39 34.54,13 34.54,12.36 31.74,10.47 | v8.64,16.93 8.64,16.42 9.14,15.92 12.95,15.92 13.46,16.42 13.46,17.06 13.93,17.53 24.63,17.53 28.87,13.29 28.62,11.24 29.88,9.57 30.41,9.57 31.74,10.47 | S1.A2 31.74,10.47
  Bottom 0.2: U$2.IO23 v8.64,16.93
SCL  (via drill 0.3)
  Top 0.2: v26.8,19.98 26.03,20.75 26.03,31.02 27.81,32.81 27.81,34.84 28.48,35.5 U2.8 32.96,35.47 34.16,35.47 35.07,36.38 35.07,40.86 35.27,41.06 R17.1
  Bottom 0.2: U$2.IO5 v18.8,16.81 18.8,19.68 19.81,20.7 26.08,20.7 v26.8,19.98
SDA  (via drill 0.3)
  Top 0.2: v21.46,35.09 27.43,35.09 28.24,35.9 30.91,35.9 31.78,36.77 U2.7 32.98,36.74 34.42,36.74 34.67,37 34.67,41.02 35.26,41.61 35.48,41.61 35.64,41.77 R18.1
  Bottom 0.2: U$2.IO27 21.34,34.97 v21.46,35.09
TX  (via drill 0.3)
  Top 0.2: U$1.8 25.23,33.2 25.23,18.71 | 25.23,18.71 30.05,13.88 32.38,13.88 32.64,13.63 S1.A4 | v9.91,16.93 9.91,17.44 11.2,18.73 25.21,18.73 25.23,18.71
  Bottom 0.2: U$2.IO22 v9.91,16.93
U0RXD  (via drill 0.3)
  Top 0.2: v12.45,16.93 12.45,17.42 12.95,17.93 24.8,17.93 29.41,13.32 29.41,13.31 30.23,12.49 30.23,12.23 29.59,11.6 29.59,11.34 S1.A1
  Bottom 0.2: U$2.RXD0 v12.45,16.93
U0TXD  (via drill 0.3)
  Top 0.2: S1.A3 31.69,12.74 30.55,12.74 24.96,18.33 11.94,18.33 11.18,17.57 v11.18,16.93
  Bottom 0.2: U$2.TXD0 v11.18,16.93
VBAT  (via drill 0.3)
  Top 0.2: R15.2 v27.18,9.82
  Bottom 0.2: v27.18,9.82 27.43,9.82 28.1,9.16 28.1,6.02 28.42,5.69 30.97,5.69 Q1.3
  Bottom 0.406: 33.14,5.67 U6.3
  Bottom 0.61: +.TP v32,3.47 v31.37,4.11 30.99,4.49 Q1.3 33.14,5.67
  other vias: 31.12,2.58